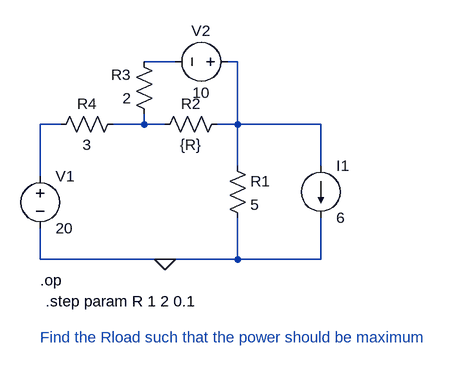
[diagram p0: schematic Lab3_ques2.asc]
Lab3_ques2.asc, the LTspice schematic file:
Version 4
SHEET 1 880 680
WIRE 256 64 208 64
WIRE 352 64 336 64
WIRE 80 160 48 160
WIRE 208 160 208 144
WIRE 208 160 160 160
WIRE 240 160 208 160
WIRE 352 160 352 64
WIRE 352 160 320 160
WIRE 480 160 352 160
WIRE 352 224 352 160
WIRE 480 224 480 160
WIRE 48 240 48 160
WIRE 48 368 48 320
WIRE 240 368 48 368
WIRE 352 368 352 304
WIRE 352 368 240 368
WIRE 480 368 480 304
WIRE 480 368 352 368
FLAG 240 368 0
SYMBOL Res 336 208 R0
SYMATTR InstName R1
SYMATTR Value 5
SYMBOL Res 336 144 R90
WINDOW 0 0 56 VBottom 2
WINDOW 3 32 56 VTop 2
SYMATTR InstName R2
SYMATTR Value {R}
SYMBOL Res 224 160 R180
WINDOW 0 36 76 Left 2
WINDOW 3 36 40 Left 2
SYMATTR InstName R3
SYMATTR Value 2
SYMBOL Res 64 176 R270
WINDOW 0 32 56 VTop 2
WINDOW 3 0 56 VBottom 2
SYMATTR InstName R4
SYMATTR Value 3
SYMBOL Voltage 48 224 R0
SYMATTR InstName V1
SYMATTR Value 20
SYMBOL Voltage 352 64 R90
WINDOW 0 -32 56 VBottom 2
WINDOW 3 32 56 VTop 2
SYMATTR InstName V2
SYMATTR Value 10
SYMBOL current 480 224 R0
SYMATTR InstName I1
SYMATTR Value 6
TEXT 48 400 Left 2 !.op
TEXT 56 432 Left 2 !.step param R 1 2 0.1
TEXT 48 488 Left 2 ;Find the Rload such that the power should be maximum

The netlist it stands for:
* Lab3_ques2.asc
R1 N002 0 5
R2 N002 N004 {R}
R3 N004 N001 2
R4 N003 N004 3
V1 N003 0 20
V2 N002 N001 10
I1 N002 0 6
.op
.step param R 1 2 0.1
* Find the Rload such that the power should be maximum
.backanno
.end